# Altium project RobotComputerVision_1.1.PrjPcb
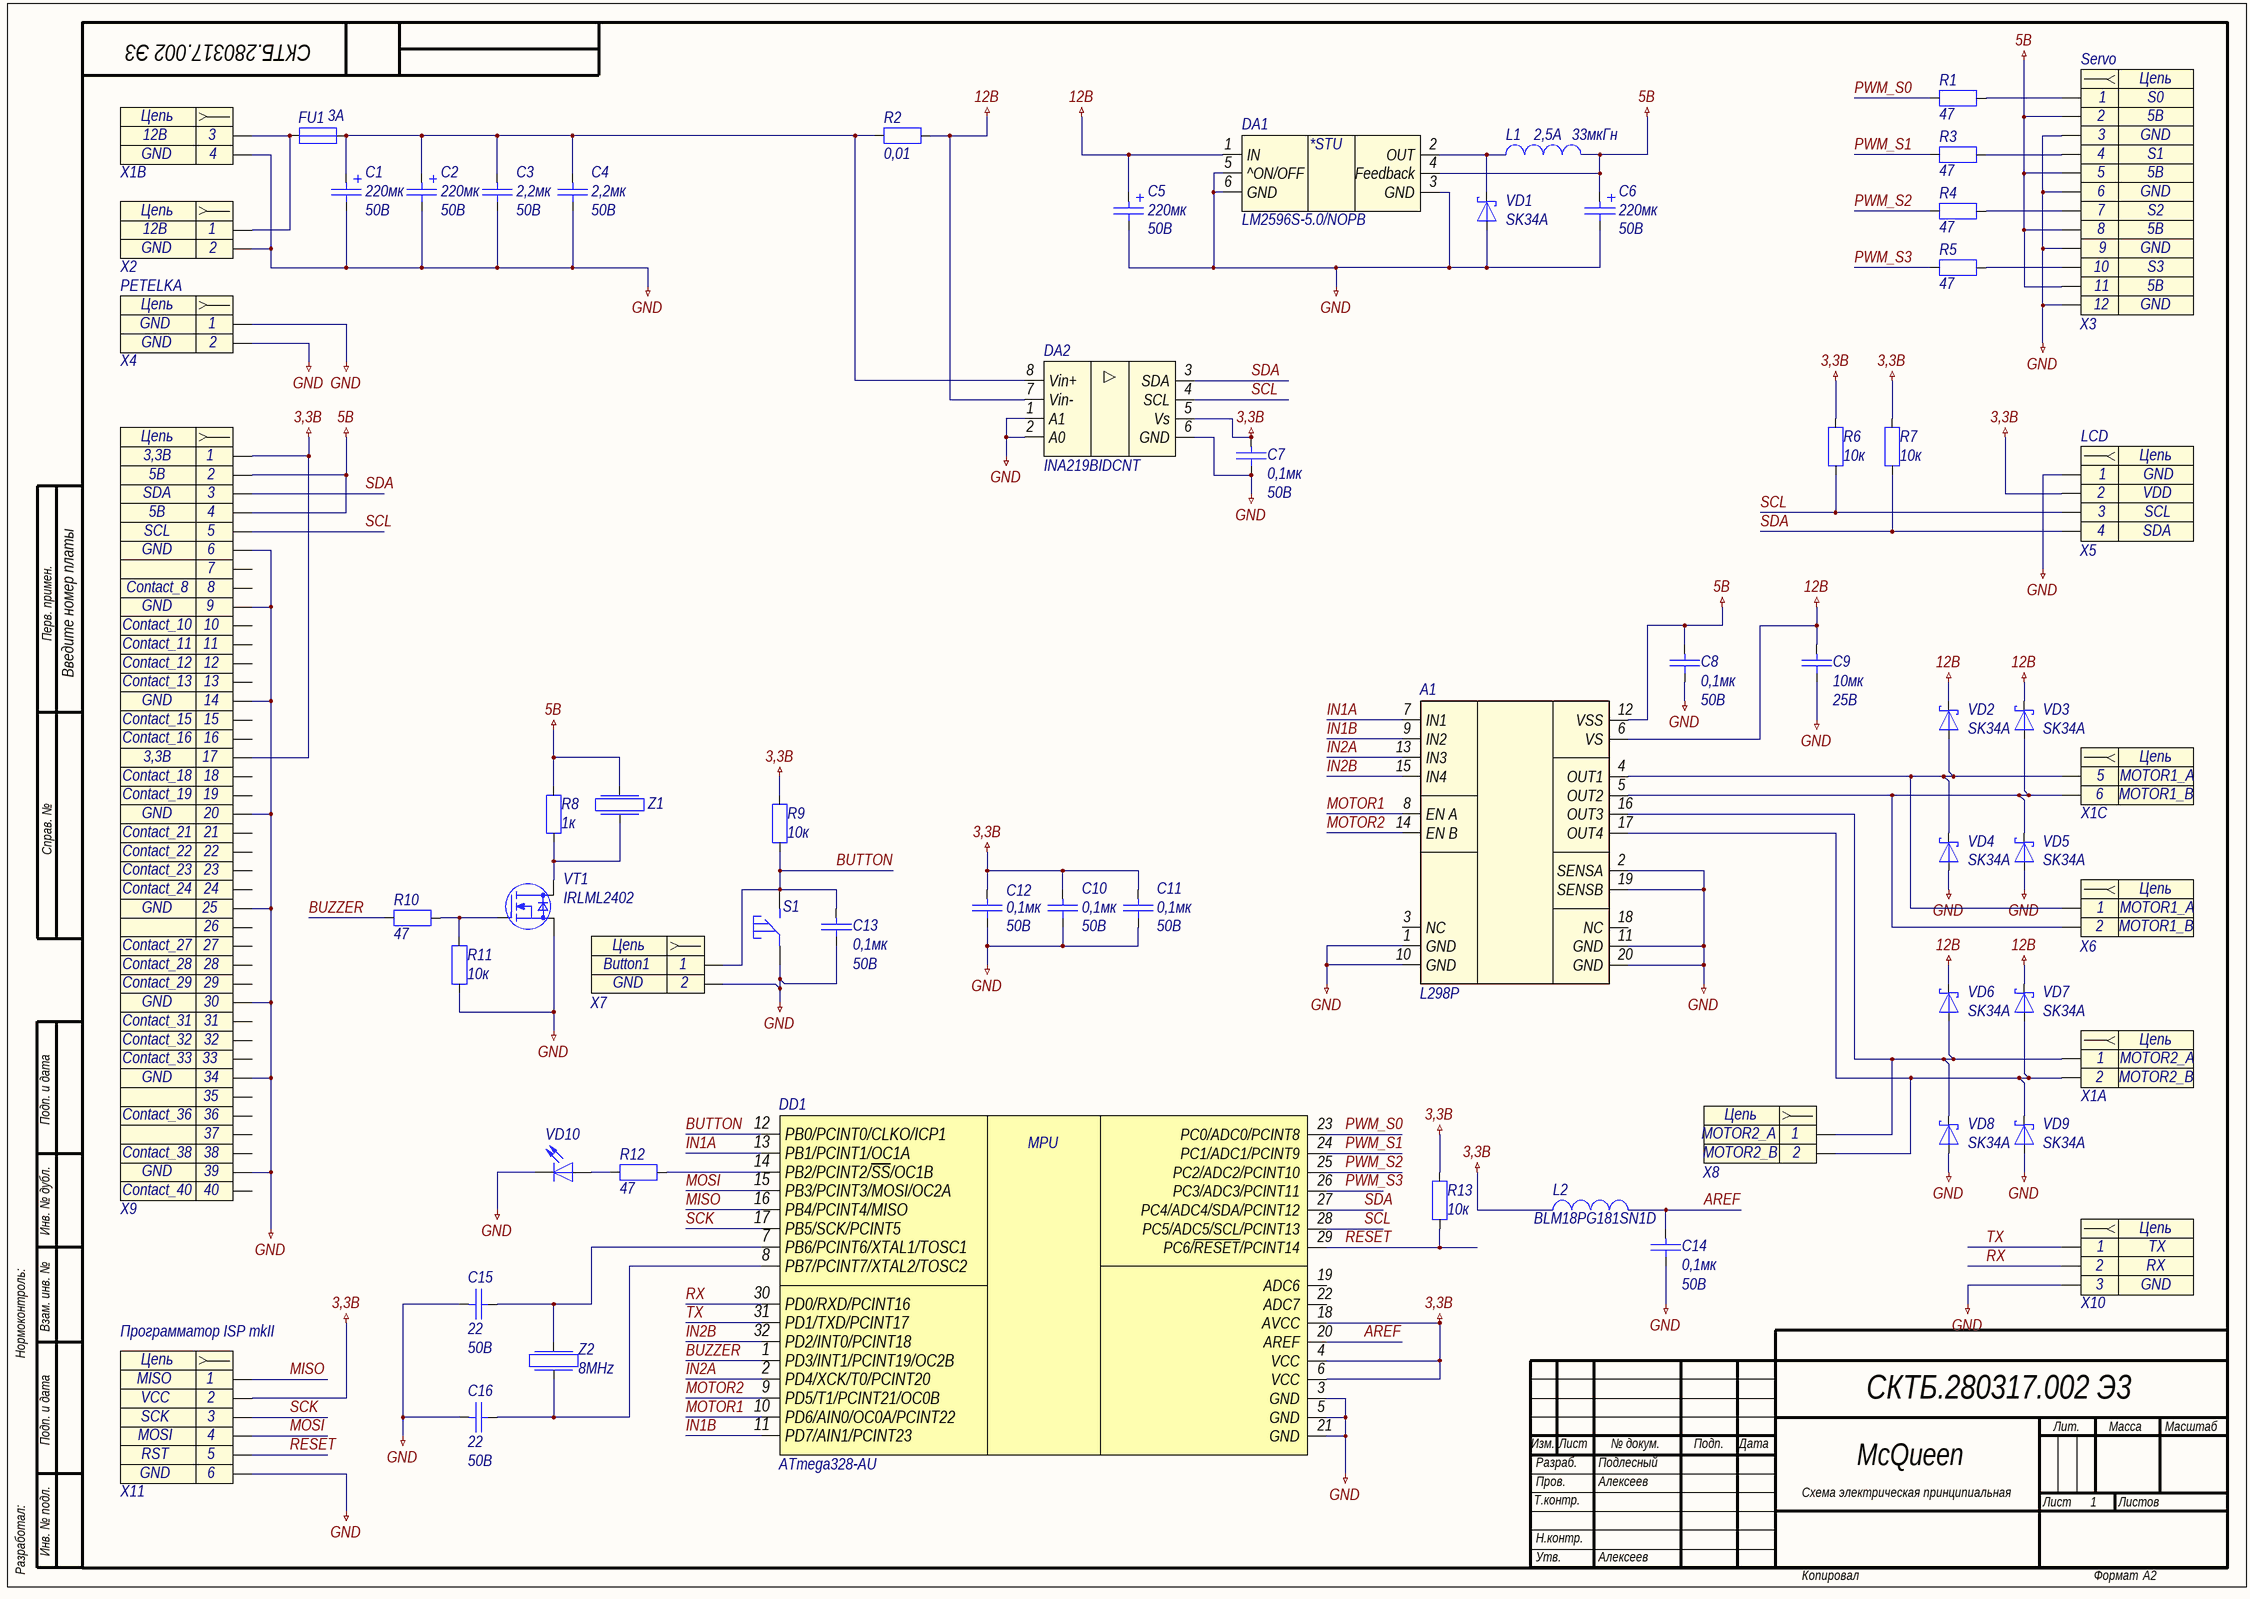
[diagram p0: RobotComputerVision_1.1.SchDoc]
1 sheet, 61 parts. Net scope: global (net labels, ports and power ports of the same name join across sheets).
Board file: RobotComputerVision_1.1.PcbDoc

## Sheet RobotComputerVision_1.1.SchDoc: Kapitoshka
size 594 x 420 mm; ApprovedBy: Алексеев; CheckedBy: Алексеев; DrawnBy: Подлесный; DocumentNumber: СКТБ.280317.002 Э3; SheetNumber: 1; Format: A2; DocumentType: Схема электрическая принципиальная; ImagePath: Введите номер платы

### Parts
A1  L298P  [POWERSO20_N]
C1  Voltage: 50В  [Cap_SMD_radial_polar(10x10.5)]  (hidden comment: 220мк)
C2  Voltage: 50В  [Cap_SMD_radial_polar(10x10.5)]  (hidden comment: 220мк)
C3  2,2мк  Voltage: 50В  [C0805]
C4  2,2мк  Voltage: 50В  [C0805]
C5  Voltage: 50В  [Cap_SMD_radial_polar(10x10.5)]  (hidden comment: 220мк)
C6  Voltage: 50В  [Cap_SMD_radial_polar(10x10.5)]  (hidden comment: 220мк)
C7  0,1мк  Voltage: 50В  [C0805]
C8  0,1мк  Voltage: 50В  [C0805]
C9  10мк  Voltage: 25В  [C1210]
C10  0,1мк  Voltage: 50В  [C0805]
C11  0,1мк  Voltage: 50В  [C0805]
C12  0,1мк  Voltage: 50В  [C0805]
C13  0,1мк  Voltage: 50В  [C0805]
C14  0,1мк  Voltage: 50В  [C0805]
C15  22  Voltage: 50В  [C0805]
C16  22  Voltage: 50В  [C0805]
DA1  LM2596S-5.0/NOPB  [TO-263]
DA2  INA219BIDCNT  [SO8]
DD1  ATmega328-AU  [TQFP-32]
FU1  value 3А  [MF-R300]  (hidden comment: MF-R300)
L1  Imax: 2,5А  [SRR1208]  (hidden comment: 33мкГн)
L2  Name: BLM18PG181SN1D  [L0603]
R1  47  [R0805]
R2  0,01  [R2512]
R3  47  [R0805]
R4  47  [R0805]
R5  47  [R0805]
R6  10к  [R0805]
R7  10к  [R0805]
R8  1к  [R0805]
R9  10к  [R0805]
R10  47  [R0805]
R11  10к  [R0805]
R12  47  [R0805]
R13  10к  [R0805]
S1  (no value)  [Button_SMD]
VD1  SK34A  [SMA]
VD2  SK34A  [SMA]
VD3  SK34A  [SMA]
VD4  SK34A  [SMA]
VD5  SK34A  [SMA]
VD6  SK34A  [SMA]
VD7  SK34A  [SMA]
VD8  SK34A  [SMA]
VD9  SK34A  [SMA]
VD10  (no value)  [D0805]
VT1  IRLML2402  [SOT23-3_H]
X1  (no value)  [DT-128V-6]  (parts A,B,C of 3)
X2  (no value)  [2HOLE_2.5]
X3  Servo  [PLS-12]
X4  PETELKA  [2HOLE_PETELKA]
X5  LCD  [PLS-4holes]
X6  (no value)  [2HOLE_2.5]
X7  (no value)  [2HOLE_2.5]
X8  (no value)  [2HOLE_2.5]
X9  (no value)  [PBS-40]
X10  (no value)  [PLS2-3holes]
X11  Программатор ISP mkII  [PLS2-6]
Z1  XXX  [Пьезоизлучатель звуковой]  (value not drawn)
Z2  8MHz  [QSMD5.0x3.2x1.0]

### Nets
3,3B: C7.1 C10.1 C11.1 C12.1 DA2.5(Vs) DD1.4(VCC) DD1.6(VCC) DD1.18(AVCC) L2.1 R6.2 R7.2 R9.2 R13.2 X5.2 X9.1 X9.17 X11.2
5В: A1.12(VSS) C6.1 C8.1 DA1.4(Feedback) L1.2 R8.2 X3.2 X3.5 X3.8 X3.11 X9.2 X9.4 Z1.1
12В: A1.6(VS) C5.1 C9.1 DA1.1(IN) DA2.7(Vin-) R2.2 VD2.1(K) VD3.1(K) VD6.1(K) VD7.1(K)
GND: A1.1(GND) A1.2(SENSA) A1.10(GND) A1.11(GND) A1.19(SENSB) A1.20(GND) C1.2 C2.2 C3.2 C4.2 C5.2 C6.2 C7.2 C8.2 C9.2 C10.2 C11.2 C12.2 C13.2 C14.2 C15.1 C16.1 DA1.3(GND) DA1.5(^ON/OFF) DA1.6(GND) DA2.1(A1) DA2.2(A0) DA2.6(GND) DD1.3(GND) DD1.5(GND) DD1.21(GND) R11.1 S1.1 VD1.2(A) VD4.2(A) VD5.2(A) VD8.2(A) VD9.2(A) VD10.1(K) VT1.2(S) X1.4 X2.2 X3.3 X3.6 X3.9 X3.12 X4.1 X4.2 X5.1 X7.2 X9.6 X9.9 X9.14 X9.20 X9.25 X9.30 X9.34 X9.39 X10.3 X11.6
AREF: C14.1 DD1.20(AREF) L2.2
BUTTON: C13.1 DD1.12(PB0/PCINT0/CLKO/ICP1) R9.1 S1.4 X7.1
BUZZER: DD1.1(PD3/INT1/PCINT19/OC2B) R10.2
IN1A: A1.7(IN1) DD1.13(PB1/PCINT1/OC1A)
IN1B: A1.9(IN2) DD1.11(PD7/AIN1/PCINT23)
IN2A: A1.13(IN3) DD1.2(PD4/XCK/T0/PCINT20)
IN2B: A1.15(IN4) DD1.32(PD2/INT0/PCINT18)
MISO: DD1.16(PB4/PCINT4/MISO) X11.1
MOSI: DD1.15(PB3/PCINT3/MOSI/OC2A) X11.4
MOTOR1: A1.8(EN_A) DD1.10(PD6/AIN0/OC0A/PCINT22)
MOTOR2: A1.14(EN_B) DD1.9(PD5/T1/PCINT21/OC0B)
PWM_S0: DD1.23(PC0/ADC0/PCINT8) R1.1
PWM_S1: DD1.24(PC1/ADC1/PCINT9) R3.1
PWM_S2: DD1.25(PC2/ADC2/PCINT10) R4.1
PWM_S3: DD1.26(PC3/ADC3/PCINT11) R5.1
RESET: DD1.29(PC6/~{RESET}/PCINT14) R13.1 X11.5
RX: DD1.30(PD0/RXD/PCINT16) X10.2
SCK: DD1.17(PB5/SCK/PCINT5) X11.3
SCL: DA2.4(SCL) DD1.28(PC5/ADC5/SCL/PCINT13) R6.1 X5.3 X9.5
SDA: DA2.3(SDA) DD1.27(PC4/ADC4/SDA/PCINT12) R7.1 X5.4 X9.3
TX: DD1.31(PD1/TXD/PCINT17) X10.1
NetA1_4: A1.4(OUT1) VD2.2(A) VD4.1(K) X1.5 X6.1
NetA1_5: A1.5(OUT2) VD3.2(A) VD5.1(K) X1.6 X6.2
NetA1_16: A1.16(OUT3) VD6.2(A) VD8.1(K) X1.1 X8.1
NetA1_17: A1.17(OUT4) VD7.2(A) VD9.1(K) X1.2 X8.2
NetC1_1: C1.1 C2.1 C3.1 C4.1 DA2.8(Vin+) FU1.2 R2.1
NetC15_2: C15.2 DD1.7(PB6/PCINT6/XTAL1/TOSC1) Z2.1
NetC16_2: C16.2 DD1.8(PB7/PCINT7/XTAL2/TOSC2) Z2.2
NetDA1_2: DA1.2(OUT) L1.1 VD1.1(K)
NetDD1_14: DD1.14(PB2/PCINT2/~{SS}/OC1B) R12.1
NetFU1_1: FU1.1 X1.3 X2.1
NetR1_2: R1.2 X3.1
NetR3_2: R3.2 X3.4
NetR4_2: R4.2 X3.7
NetR5_2: R5.2 X3.10
NetR8_1: R8.1 VT1.3(D) Z1.2
NetR10_1: R10.1 R11.2 VT1.1(G)
NetR12_2: R12.2 VD10.2(A)

Not connected (* = marked no-connect by the designer): A1 3(NC) 18(NC); DD1 19(ADC6) 22(ADC7); X9 7 8 10 11 12 13 15 16 18 19 21 22 23 24 26 27 28 29 31 32 33 35 36 37 38 40

### Notes on the sheet
- Перв. примен.
- Справ. №
- Подп. и дата
- Инв. № дубл.
- Нормоконтроль:
- Взам. инв. №
- Изм.
- Лист
- № докум.
- Подп.
- Дата
- Лит.
- Масса
- Масштаб
- Т.контр.
- Пров.
- Разраб.
- McQueen
- Листов
- Разработал:
- Инв. № подл.
- Н.контр.
- Утв.
- Копировал
- Формат
- (in symbol ATmega328-AU) MPU
- (in symbol Header_2_sct) Цепь
- (in symbol Header_3_sct) Цепь
- (in symbol Header_4_sct) Цепь
- (in symbol Header_6_motor, part A) Цепь
- (in symbol Header_6_motor, part B) Цепь
- (in symbol Header_6_motor, part C) Цепь
- (in symbol Header_6_sct) Цепь
- (in symbol Header_12) Цепь
- (in symbol Header_40) Цепь
- (in symbol LM2596) *STU

### Library data of the parts
A1 = L298: FULL BRIDGE DC MOTOR DRIVER; Name: L298P
C1 C2 C5 C6 = Capacitor_pol: Конденсатор полярный; Value: 220мк
C3 C4 C7-C16 = Capacitor: Конденсатор
  C3 C4: Value: 2,2мк
  C7 C8 C10-C14: Value: 0,1мк
  C9: Value: 10мк
  C15 C16: Value: 22
DA1 = LM2596: 3-A Step-Down Voltage Regulator
DA2 = INA219: Токочувствительный усилитель; Name: INA219BIDCNT
DD1 = ATmega328-AU: Микроконтроллер 8-Бит, AVR, 16МГц, 8КБ Flash; Name: ATmega328-AU
FU1 = Fuse: Предохранитель; Name: MF-R300
L1 L2 = Inductor: Катушка индуктивности
  L1: Value: 33мкГн
R1-R13 = Resistor: Резистор
  R1 R3-R5 R10 R12: Value: 47
  R2: Value: 0,01
  R6 R7 R9 R11 R13: Value: 10к
  R8: Value: 1к
S1 = Button_SMD: Кнопка
VD1-VD9 = DiodeSchottky: Диод Шоттки; Name: SK34A
VD10 = LED_L: Светодиод
VT1 = N-MOSFET: Name: IRLML2402; Vgs: *; Vds: *; Ids: *
X1 = Header_6_motor: POWER; Contact_2: MOTOR2_B; Contact_1: MOTOR2_A; Contact_5: Contact_5; Contact_6: Contact_6; Contact_4: Contact_4; Contact_3: Contact_3
X2 = Header_2_sct: Разъем - 2 конт. розетка; Contact_1: 12В; Contact_2: GND
X3 = Header_12: Разъем - 5 конт. розетка; Contact_1: S0; Contact_2: 5B; Contact_3: GND; Contact_7: S2; Contact_10: S3; Contact_4: S1; Name: Servo; Contact_5: 5B; Contact_6: GND; Contact_8: 5B; Contact_9: GND; Contact_11: 5B; Contact_12: GND
X4 = Header_2_sct: Разъем - 2 конт. розетка; Contact_1: GND; Contact_2: GND; Name: PETELKA
X5 = Header_4_sct: Разъем - 4 конт. розетка; Contact_1: GND; Contact_2: VDD; Contact_3: SCL; Contact_4: SDA; Name: LCD
X6 = Header_2_sct: Разъем - 2 конт. розетка; Contact_1: MOTOR1_A; Contact_2: MOTOR1_B
X7 = Header_2_sct: Разъем - 2 конт. розетка; Contact_1: Button1; Contact_2: GND
X8 = Header_2_sct: Разъем - 2 конт. розетка; Contact_1: MOTOR2_A; Contact_2: MOTOR2_B
X9 = Header_40: Разъем - 5 конт. розетка; Contact_1: 3,3B; Contact_2: 5B; Contact_3: SDA; Contact_5: SCL; Contact_6: GND; Contact_8: Contact_8; Contact_9: GND; Contact_10: Contact_10; Contact_11: Contact_11; Contact_12: Contact_12; Contact_13: Contact_13; Contact_14: GND; Contact_15: Contact_15; Contact_16: Contact_16; Contact_17: 3,3B; Contact_18: Contact_18; Contact_19: Contact_19; Contact_20: GND; Contact_21: Contact_21; Contact_22: Contact_22; Contact_23: Contact_23; Contact_24: Contact_24; Contact_25: GND; Contact_27: Contact_27; Contact_28: Contact_28; Contact_29: Contact_29; Contact_30: GND; Contact_31: Contact_31; Contact_32: Contact_32; Contact_33: Contact_33; Contact_34: GND; Contact_36: Contact_36; Contact_38: Contact_38; Contact_39: GND; Contact_40: Contact_40; Contact_4: 5B
X10 = Header_3_sct: Разъем - 2 конт. розетка; Contact_1: TX; Contact_2: RX; Contact_3: GND
X11 = Header_6_sct: Разъем - 5 конт. розетка; Contact_1: MISO; Contact_2: VCC; Contact_3: SCK; Contact_4: MOSI; Contact_5: RST; Contact_6: GND; Name: Программатор ISP mkII
Z1 = Buzzer: Пьезоизлучатель звуковой; Value: XXX
Z2 = Crystal: Кварцевый резонатор; Value: 8MHz